# EasyEDA Pro project ProPrj_STM32H730_ESP-Hosted_EVB_2025-02-02.epro, board PCB2
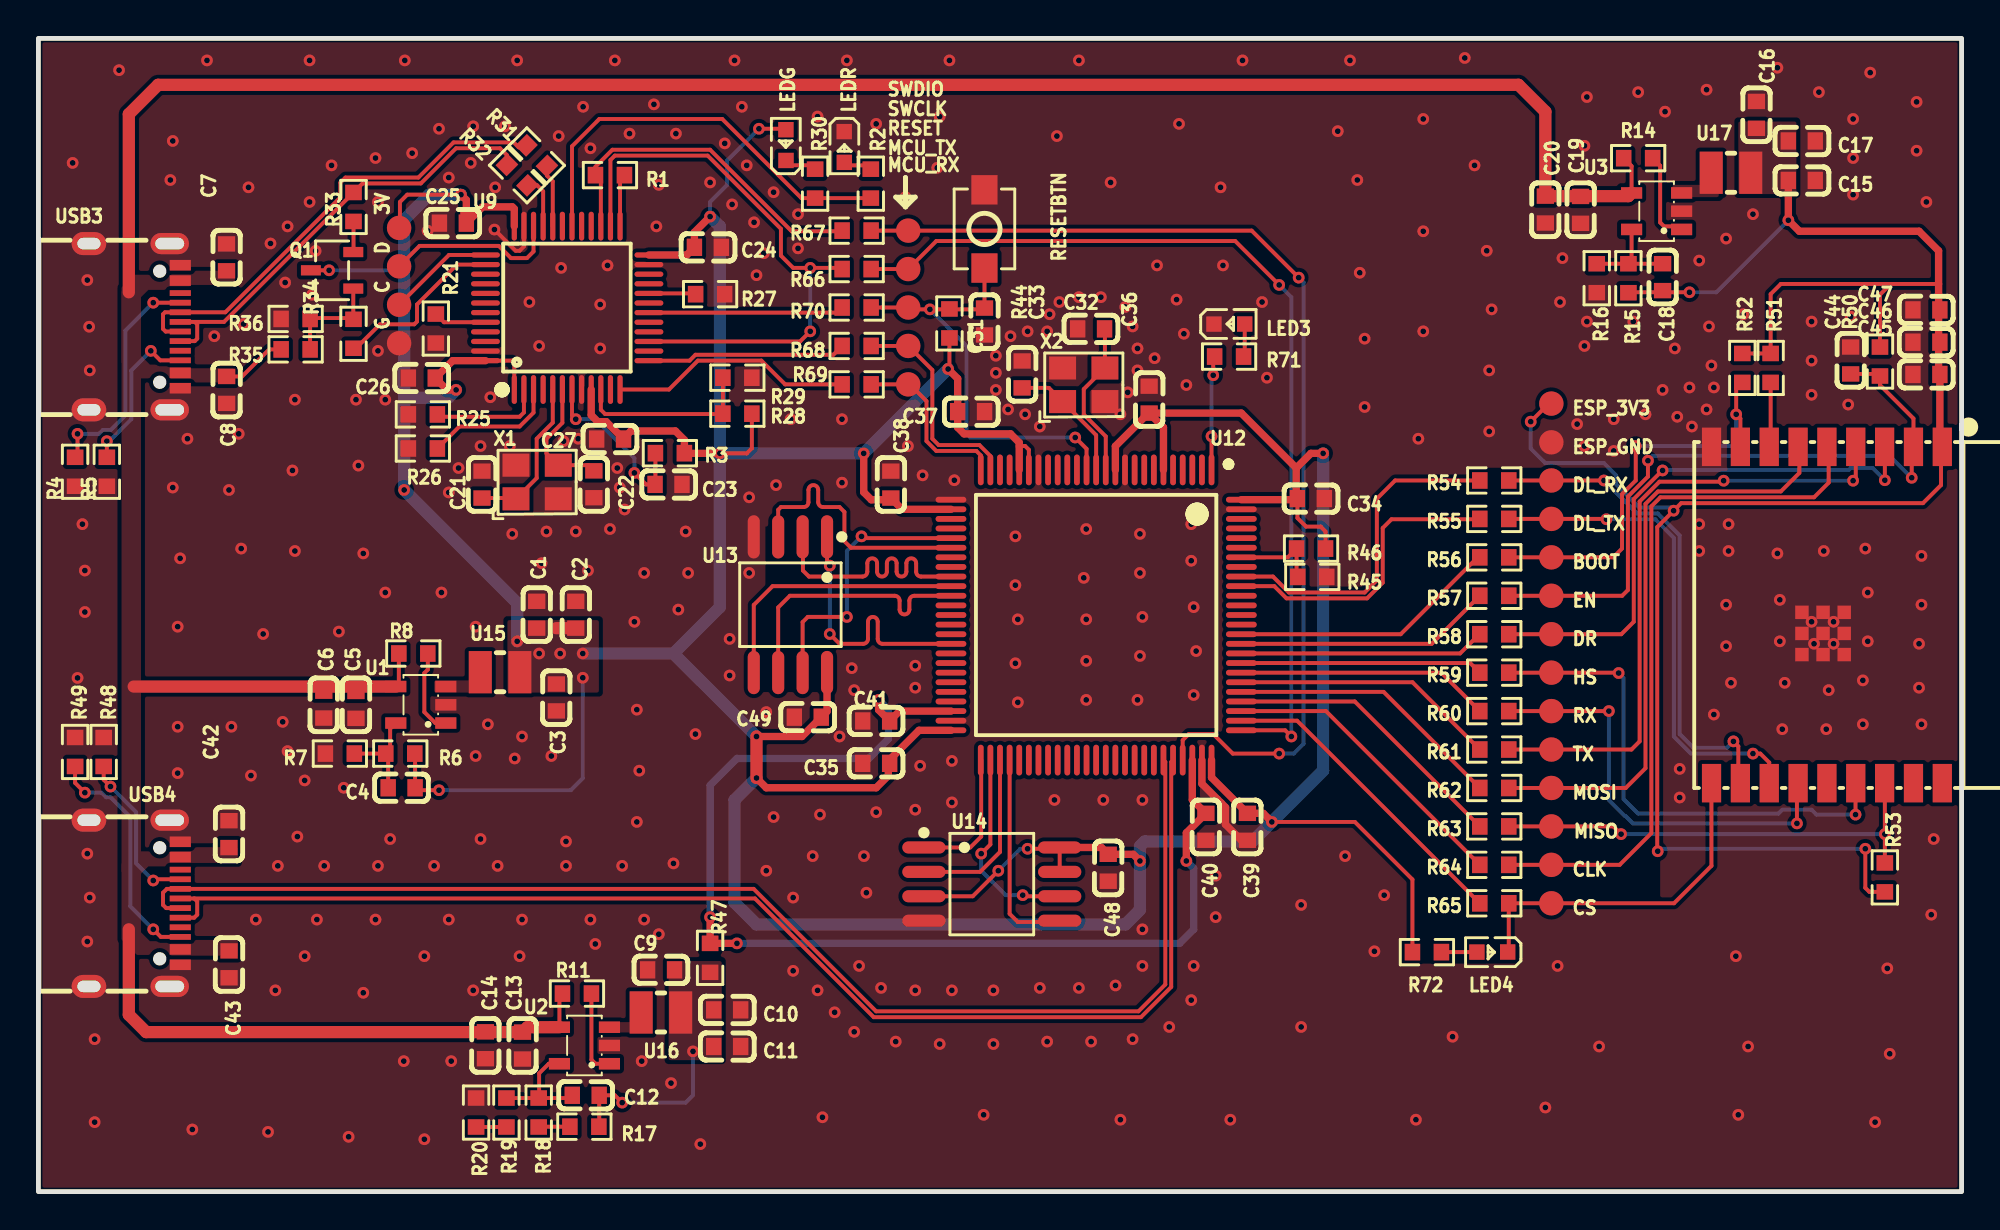
[diagram p5: board, top side]
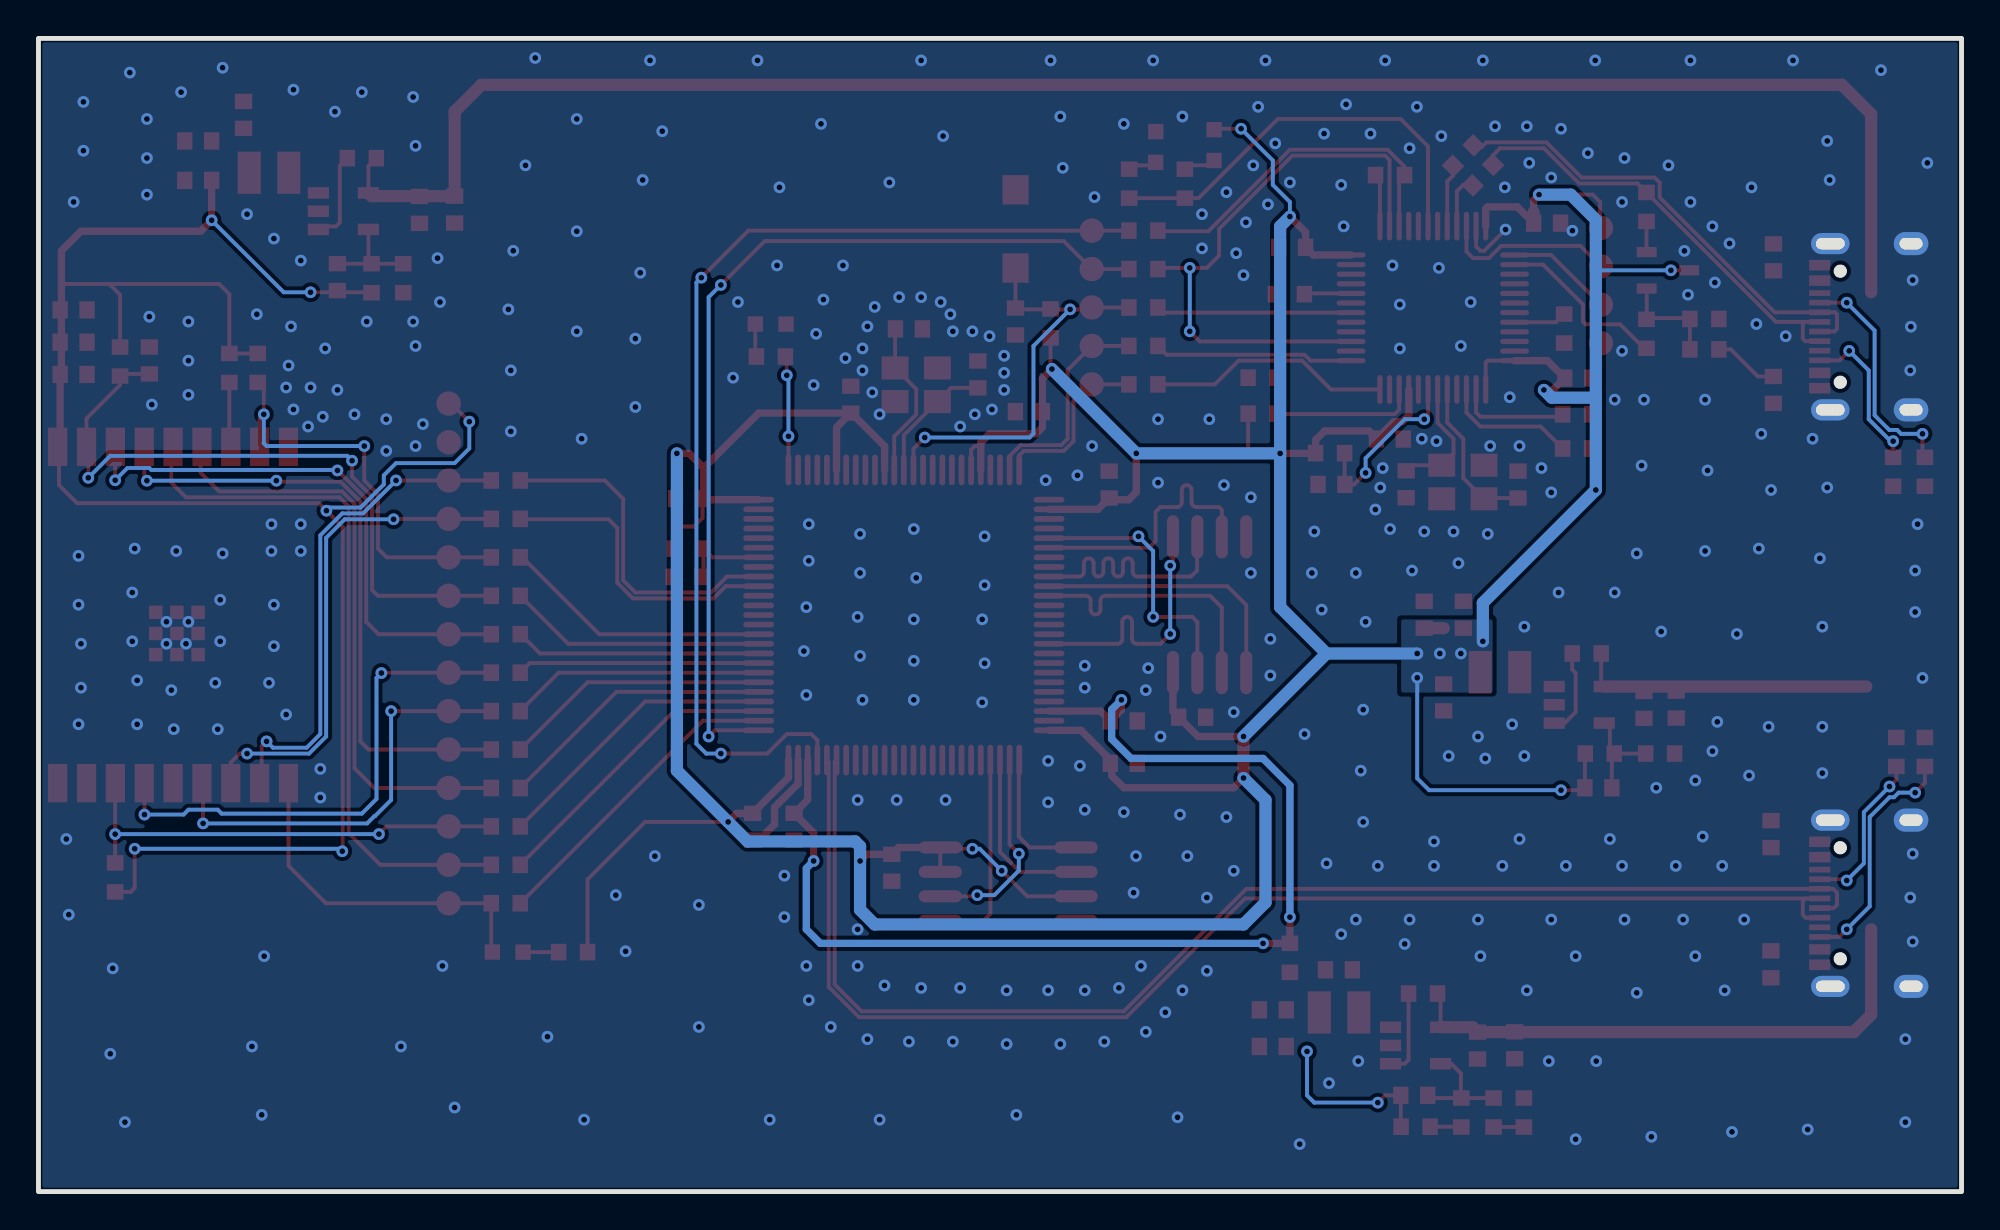
[diagram p6: board, bottom side, seen from below]

Outline 100 x 60 mm; copper layers: Top Layer, Bottom Layer. Coordinates in mm from the lower left corner of the outline.
Outline path: rectangle 0,60 100,0
Stack: Top Layer 0.035mm / Dielectric1 1.51mm FR4 er 4.5 / Bottom Layer 0.035mm

## Design rules (mm)
template: 自定义配置
spacing copperThickness1oz (default): track to track 0.102, other pairs 0.152 to 0.3
spacing copperThickness2oz: track to track 0.203, other pairs 0.152 to 0.3
track width copperThickness1oz (default): min 0.127, default 0.203, max 2.54
track width copperThickness2oz: min 0.203, default 0.254, max 2.54
differential pair differentialPair (default): width min 0.127, default 0.254, max 2.54; gap min 0.152, default 0.152
via viaSize (default): diameter min 0.5, default 0.61, max 10; hole min 0.3, default 0.305, max 6.299
pour e1192 uses ALL
pour e1223 uses ALL
pour e1563 uses ALL
pour e1588 uses ALL
pour e1603 uses ALL
pour e1605 uses ALL
pour e1638 uses ALL
pour e86 uses ALL
pour e163 uses ALL
pour e202 uses ALL
pour e339 uses ALL
pour e588 uses ALL
pour e685 uses ALL
pour e821 uses ALL
pour e1178 uses ALL
pour e1238 uses ALL

## Placement (name value [footprint] x y rotation side)
3V  -  [Test-Point-0.5mm]  18.75 50.14 0 top
BOOT  -  [Test-Point-0.5mm]  78.67 33 0 top
C  -  [Test-Point-0.5mm]  18.75 46.14 0 top
C1  100nF  [C0603]  25.91 30.01 270 top
C2  10uF  [C0603]  27.94 30.01 270 top
C3  10uF  [C0603]  26.93 25.71 90 top
C4  22p  [C0603]  18.89 21.01 0 top
C5  100nF  [C0603]  16.51 25.32 270 top
C6  10uF  [C0603]  14.84 25.34 90 top
C7  10uF  [C0603]  9.78 48.61 270 top
C8  10uF  [C0603]  9.78 41.71 90 top
C9  100nF  [C0603]  32.38 11.54 0 top
C10  10uF  [C0603]  35.81 9.45 180 top
C11  10uF  [C0603]  35.81 7.55 180 top
C12  22p  [C0603]  28.46 5.01 0 top
C13  100nF  [C0603]  25.17 7.6 270 top
C14  10uF  [C0603]  23.24 7.61 90 top
C15  100nF  [C0603]  91.69 52.61 180 top
C16  10uF  [C0603]  89.33 56.02 270 top
C17  10uF  [C0603]  91.69 54.67 180 top
C18  22p  [C0603]  84.46 47.58 270 top
C19  100nF  [C0603]  80.19 51.08 270 top
C20  10uF  [C0603]  78.36 51.09 90 top
C21  12p  [C0603]  23.06 36.79 270 top
C22  12p  [C0603]  28.88 36.8 90 top
C23  100nF  [C0603]  32.76 36.8 180 top
C24  100nF  [C0603]  34.81 49.13 180 top
C25  100nF  [C0603]  21.55 50.39 0 top
C26  100nF  [C0603]  19.93 42.33 0 top
C27  100nF  [C0603]  29.73 39.16 0 top
C31  22p  [C0603]  51.15 42.52 270 top
C32  22p  [C0603]  54.74 44.89 0 top
C33  100nF  [C0603]  49.19 45.27 90 top
C34  100nF  [C0603]  66.17 36.06 180 top
C35  100nF  [C0603]  43.56 22.28 0 top
C36  100nF  [C0603]  57.76 41.2 270 top
C37  100nF  [C0603]  48.5 40.58 180 top
C38  100nF  [C0603]  44.32 36.79 270 top
C39  100nF  [C0603]  62.87 18.98 90 top
C40  2.2uF  [C0603]  60.71 18.98 90 top
C41  2.2uF  [C0603]  43.56 24.49 0 top
C42  10uF  [C0603]  9.91 18.6 270 top
C43  10uF  [C0603]  9.91 11.82 90 top
C44  1uF  [C0603]  94.23 43.24 270 top
C45  100nF  [C0603]  98.17 42.52 0 top
C46  10uF  [C0603]  98.17 44.2 0 top
C47  10uF  [C0603]  98.17 45.88 0 top
C48  100nF  [C0603]  55.63 16.85 90 top
C49  100nF  [C0603]  40 24.68 0 top
CLK  -  [Test-Point-0.5mm]  78.67 17 0 top
CS  -  [Test-Point-0.5mm]  78.67 15 0 top
D  -  [Test-Point-0.5mm]  18.75 48.14 0 top
DL_RX  -  [Test-Point-0.5mm]  78.67 37 0 top
DL_TX  -  [Test-Point-0.5mm]  78.67 35 0 top
DR  -  [Test-Point-0.5mm]  78.67 29 0 top
EN  -  [Test-Point-0.5mm]  78.67 31 0 top
ESP_3V3  -  [Test-Point-0.5mm]  78.67 41 0 top
ESP_GND  -  [Test-Point-0.5mm]  78.67 38.98 0 top
G  -  [Test-Point-0.5mm]  18.75 44.14 0 top
HS  -  [Test-Point-0.5mm]  78.67 27 0 top
LED3  -  [LED_0603]  61.98 45.15 0 top
LED4  -  [LED_0603]  75.55 12.45 180 top
LEDG  -  [LED_0603]  38.86 54.5 90 top
LEDR  -  [LED_0603]  41.91 54.3 270 top
MCU_RX  -  [Test-Point-0.5mm]  45.23 42 0 top
MCU_TX  -  [Test-Point-0.5mm]  45.23 44 0 top
MISO  -  [Test-Point-0.5mm]  78.67 19 0 top
MOSI  -  [Test-Point-0.5mm]  78.67 21 0 top
Q1  S8050  [SOT-23-3_L3.0-W1.7-P0.95-LS2.9-BR]  15.27 47.94 0 top
R1  100R  [R0603]  29.72 52.89 180 top
R2  1k  [R0603]  43.28 52.44 90 top
R3  10K  [R0603]  32.84 38.42 0 top
R4  5K1  [R0603]  1.91 37.45 270 top
R5  5K1  [R0603]  3.56 37.45 270 top
R6  100k  [R0603]  18.81 22.79 0 top
R7  22.1k  [R0603]  15.67 22.79 0 top
R8  100K  [R0603]  19.49 28 180 top
R11  100K  [R0603]  28 10.3 180 top
R14  100K  [R0603]  83.19 53.77 180 top
R15  100k  [R0603]  82.68 47.52 270 top
R16  22.1k  [R0603]  81.03 47.52 90 top
R17  51k  [R0603]  28.39 3.38 0 top
R18  100k  [R0603]  26.01 4.11 90 top
R19  100k  [R0603]  24.33 4.11 90 top
R20  15k  [R0603]  22.76 4.11 90 top
R21  10K  [R0603]  20.66 44.9 90 top
R25  10k  [R0603]  19.99 40.44 180 top
R26  10k  [R0603]  19.99 38.66 180 top
R27  10k  [R0603]  34.93 46.69 0 top
R28  10K  [R0603]  36.34 40.48 0 top
R29  10K  [R0603]  36.34 42.35 180 top
R30  1k  [R0603]  40.39 52.44 90 top
R31  22R  [R0603]  25.91 53.9 315 top
R32  22R  [R0603]  24.89 52.89 315 top
R33  1.5K  [R0603]  16.38 51.23 270 top
R34  100R  [R0603]  16.38 44.63 270 top
R35  10K  [R0603]  13.37 43.82 180 top
R36  36K  [R0603]  13.37 45.41 0 top
R44  10K  [R0603]  47.37 45.17 90 top
R45  10K  [R0603]  66.24 31.98 0 top
R46  NC  [R0603]  66.17 33.46 0 top
R47  0R  [R0603]  34.93 12.16 270 top
R48  5K1  [R0603]  3.39 22.87 90 top
R49  5K1  [R0603]  1.91 22.87 90 top
R50  10K  [R0603]  95.76 43.19 270 top
R51  10K  [R0603]  90.07 42.86 270 top
R52  10K  [R0603]  88.6 42.86 270 top
R53  10K  [R0603]  96.01 16.35 270 top
R54  10R  [R0603]  75.7 37 0 top
R55  10R  [R0603]  75.7 35 0 top
R56  10R  [R0603]  75.7 33 0 top
R57  10R  [R0603]  75.7 31 0 top
R58  10R  [R0603]  75.7 29 0 top
R59  10R  [R0603]  75.7 27 0 top
R60  10R  [R0603]  75.7 25 0 top
R61  10R  [R0603]  75.7 23 0 top
R62  10R  [R0603]  75.7 21 0 top
R63  10R  [R0603]  75.7 19 0 top
R64  10R  [R0603]  75.7 17 0 top
R65  10R  [R0603]  75.7 15 0 top
R66  10R  [R0603]  42.54 48 180 top
R67  10R  [R0603]  42.54 50 180 top
R68  10R  [R0603]  42.54 44 0 top
R69  10R  [R0603]  42.54 42 0 top
R70  10R  [R0603]  42.54 46 0 top
R71  1K  [R0603]  61.91 43.45 180 top
R72  1K  [R0603]  72.2 12.46 180 top
RESET  -  [Test-Point-0.5mm]  45.23 46 0 top
RESETBTN  TS342A2P-WZ  [SW-SMD_L4.0-W2.9-LS5.0]  49.19 50.09 90 top
RX  -  [Test-Point-0.5mm]  78.67 25 0 top
SWCLK  -  [Test-Point-0.5mm]  45.23 48 0 top
SWDIO  -  [Test-Point-0.5mm]  45.23 50 0 top
TX  -  [Test-Point-0.5mm]  78.67 23 0 top
U1  SY8088AAC  [SOT-23-5_L3.0-W1.7-P0.95-LS2.8-BR]  19.88 25.33 0 top
U2  SY8088AAC  [SOT-23-5_L3.0-W1.7-P0.95-LS2.8-BR]  28.39 7.6 0 top
U3  SY8088AAC  [SOT-23-5_L3.0-W1.7-P0.95-LS2.8-BR]  84.14 51.01 0 top
U9  STM32F103CBT6  [LQFP-48_L7.0-W7.0-P0.50-LS9.0-BL]  27.49 45.98 0 top
U10  ESP32-C3-WROOM-02  [BULETM-SMD_ESPRESSIF_ESP32-C3-WROOM-02-N4-4MB]  93 30 270 top
U12  STM32H730VBT6TR  [LQFP-100_L14.0-W14.0-P0.50-LS16.0-BL]  55 30 180 top
U13  W25Q32JVSSIQ  [SOIC-8_L5.3-W5.3-P1.27-LS8.0-BL]  39.1 30.54 180 top
U14  W25Q32JVSSIQ  [SOIC-8_L5.3-W5.3-P1.27-LS8.0-BL]  49.57 16 270 top
U15  2.2uH  [IND-SMD_L2.5-W2.0]  24 27.02 180 top
U16  2.2uH  [IND-SMD_L2.5-W2.0]  32.37 9.32 180 top
U17  2.2uH  [IND-SMD_L2.5-W2.0]  88.01 53.01 180 top
USB3  TYPE-C 16PIN 2MD(073)  [USB-C-SMD_TYPE-C-6PIN-2MD-073]  5 45 270 top
USB4  TYPE-C 16PIN 2MD(073)  [USB-C-SMD_TYPE-C-6PIN-2MD-073]  5 15 270 top
X1  8MHz  [OSC-SMD_4P-L3.2-W2.5-BL]  25.93 36.92 0 top
X2  25MHz  [OSC-SMD_4P-L3.2-W2.5-BL]  54.36 41.98 0 top

## Footprints (pads in the part's own frame, mm; a bottom-side part is the same pattern mirrored in y, then rotated)
BULETM-SMD_ESPRESSIF_ESP32-C3-WROOM-02-N4-4MB
  rect 2x1 smd: 1(-8.75,6) 2(-8.75,4.5) 3(-8.75,3) 4(-8.75,1.5) 5(-8.75,0) 6(-8.75,-1.5) 7(-8.75,-3) 8(-8.75,-4.5) 9(-8.75,-6) 10(8.75,-6) 11(8.75,-4.5) 12(8.75,-3) 13(8.75,-1.5) 14(8.75,0) 15(8.75,1.5) 16(8.75,3) 17(8.75,4.5) 18(8.75,6)
  rect 0.7x0.7 smd: 19(-0.14,0.9) 19(-0.14,-0.2) 19(-0.14,-1.3) 19(0.96,0.9) 19(0.96,-0.2) 19(0.96,-1.3) 19(2.06,0.9) 19(2.06,-0.2) 19(2.06,-1.3)
C0603
  rect 0.8x0.9 smd: 1(-0.7,0) 2(0.7,0)
IND-SMD_L2.5-W2.0
  rect 1.2x2.2 smd: 1(1.028,0) 2(-1.028,0)
LED_0603
  rect 0.8x0.8 smd: 1(-0.851,-0.01) 2(0.75,-0.005)
LQFP-48_L7.0-W7.0-P0.50-LS9.0-BL
  oval 0.27x1.5 smd: 1(-2.75,-4.25) 2(-2.25,-4.25) 3(-1.75,-4.25) 4(-1.25,-4.25) 5(-0.75,-4.25) 6(-0.25,-4.25) 7(0.25,-4.25) 8(0.75,-4.25) 9(1.25,-4.25) 10(1.75,-4.25) 11(2.25,-4.25) 12(2.75,-4.25) 25(2.75,4.25) 26(2.25,4.25) 27(1.75,4.25) 28(1.25,4.25) 29(0.75,4.25) 30(0.25,4.25) 31(-0.25,4.25) 32(-0.75,4.25) 33(-1.25,4.25) 34(-1.75,4.25) 35(-2.25,4.25) 36(-2.75,4.25)
  oval 1.5x0.27 smd: 13(4.25,-2.75) 14(4.25,-2.25) 15(4.25,-1.75) 16(4.25,-1.25) 17(4.25,-0.75) 18(4.25,-0.25) 19(4.25,0.25) 20(4.25,0.75) 21(4.25,1.25) 22(4.25,1.75) 23(4.25,2.25) 24(4.25,2.75) 37(-4.25,2.75) 38(-4.25,2.25) 39(-4.25,1.75) 40(-4.25,1.25) 41(-4.25,0.75) 42(-4.25,0.25) 43(-4.25,-0.25) 44(-4.25,-0.75) 45(-4.25,-1.25) 46(-4.25,-1.75) 47(-4.25,-2.25) 48(-4.25,-2.75)
LQFP-100_L14.0-W14.0-P0.50-LS16.0-BL
  oval 0.3x1.6 smd: 1(-6,-7.55) 2(-5.5,-7.55) 3(-5,-7.55) 4(-4.5,-7.55) 5(-4,-7.55) 6(-3.5,-7.55) 7(-3,-7.55) 8(-2.5,-7.55) 9(-2,-7.55) 10(-1.5,-7.55) 11(-1,-7.55) 12(-0.5,-7.55) 13(0,-7.55) 14(0.5,-7.55) 15(1,-7.55) 16(1.5,-7.55) 17(2,-7.55) 18(2.5,-7.55) 19(3,-7.55) 20(3.5,-7.55) 21(4,-7.55) 22(4.5,-7.55) 23(5,-7.55) 24(5.5,-7.55) 25(6,-7.55) 51(6,7.55) 52(5.5,7.55) 53(5,7.55) 54(4.5,7.55) 55(4,7.55) 56(3.5,7.55) 57(3,7.55) 58(2.5,7.55) 59(2,7.55) 60(1.5,7.55) 61(1,7.55) 62(0.5,7.55) 63(0,7.55) 64(-0.5,7.55) 65(-1,7.55) 66(-1.5,7.55) 67(-2,7.55) 68(-2.5,7.55) 69(-3,7.55) 70(-3.5,7.55) 71(-4,7.55) 72(-4.5,7.55) 73(-5,7.55) 74(-5.5,7.55) 75(-6,7.55)
  oval 1.6x0.3 smd: 26(7.55,-6) 27(7.55,-5.5) 28(7.55,-5) 29(7.55,-4.5) 30(7.55,-4) 31(7.55,-3.5) 32(7.55,-3) 33(7.55,-2.5) 34(7.55,-2) 35(7.55,-1.5) 36(7.55,-1) 37(7.55,-0.5) 38(7.55,0) 39(7.55,0.5) 40(7.55,1) 41(7.55,1.5) 42(7.55,2) 43(7.55,2.5) 44(7.55,3) 45(7.55,3.5) 46(7.55,4) 47(7.55,4.5) 48(7.55,5) 49(7.55,5.5) 50(7.55,6) 76(-7.55,6) 77(-7.55,5.5) 78(-7.55,5) 79(-7.55,4.5) 80(-7.55,4) 81(-7.55,3.5) 82(-7.55,3) 83(-7.55,2.5) 84(-7.55,2) 85(-7.55,1.5) 86(-7.55,1) 87(-7.55,0.5) 88(-7.55,0) 89(-7.55,-0.5) 90(-7.55,-1) 91(-7.55,-1.5) 92(-7.55,-2) 93(-7.55,-2.5) 94(-7.55,-3) 95(-7.55,-3.5) 96(-7.55,-4) 97(-7.55,-4.5) 98(-7.55,-5) 99(-7.55,-5.5) 100(-7.55,-6)
OSC-SMD_4P-L3.2-W2.5-BL
  rect 1.4x1.2 smd: 1(-1.1,-0.875) 2(1.1,-0.875) 3(1.1,0.875) 4(-1.1,0.875)
R0603
  rect 0.806x0.864 smd: 1(-0.753,0) 2(0.753,0)
SOIC-8_L5.3-W5.3-P1.27-LS8.0-BL
  oval 0.63x2.25 smd: 1(-1.905,-3.53) 2(-0.635,-3.53) 3(0.635,-3.53) 4(1.905,-3.53) 5(1.905,3.53) 6(0.635,3.53) 7(-0.635,3.53) 8(-1.905,3.53)
SOT-23-3_L3.0-W1.7-P0.95-LS2.9-BR
  rect 1.038x0.532 smd: 1(1.101,-0.95) 2(1.101,0.95) 3(-1.101,0)
SOT-23-5_L3.0-W1.7-P0.95-LS2.8-BR
  rect 1.1x0.6 smd: 1(1.3,-0.95) 2(1.3,0) 3(1.3,0.95) 4(-1.3,0.95) 5(-1.3,-0.95)
SW-SMD_L4.0-W2.9-LS5.0
  rect 1.53x1.36 smd: 1(-2.035,0) 2(2.035,0)
Test-Point-0.5mm
  round 1.27 smd: 1(0,0)
USB-C-SMD_TYPE-C-6PIN-2MD-073
  rect 0.55x1.1 smd: 1(-3.2,2.375) 2(-2.4,2.375) 11(2.4,2.375) 12(3.2,2.375)
  rect 0.3x1.1 smd: 3(-1.75,2.375) 4(-1.25,2.375) 5(-0.75,2.375) 6(-0.25,2.375) 7(0.25,2.375) 8(0.75,2.375) 9(1.25,2.375) 10(1.75,2.375)
  oval 1.1x2 hole 0.6x1.5: 13(-4.325,1.825) 14(4.325,1.825)
  oval 1.2x1.8 hole 0.6x1.2: 13(-4.325,-2.375) 14(4.325,-2.375)

## Nets
As in the schematic.

Pads without a net: U9 4 11 14 16 17 19 21 22 28 29 31 39 40 41 42 43 45 46; U10 17 18; U12 2 3 4 5 7 8 9 15 16 17 18 22 23 28 29 32 33 37 38 39 40 42 43 44 45 46 47 55 56 57 58 59 60 61 62 63 64 65 66 67 68 69 87 88 89 90 93 95 96 97 98; USB3 3 9; USB4 3 9

## Via types
v1: diameter 0.61, hole 0.305, Top Layer to Bottom Layer, 469 vias

## Routing (per net, layer and track width the routed paths; a pad name or vN(x,y) marks a point on that pad's centre or on a via; arc(x,y) is an arc through that point)
+3.3V_ESP: length 108.2
  Top Layer w0.203: U10.1 98.93,38.68 98.93,36.76 97.99,35.82 85.42,35.82 v1(85.03,35.43) 84.18,34.58 84.18,17.73 v1(84.2,17.71) ; 96.32,47.22 90.6,47.22 90.07,46.7 R51.1 R52.1 ; 96.32,47.22 98.81,47.22 ; 96.32,47.22 95.76,46.67 R50.1 ; v1(85.85,46.79) 82.7,46.79 R15.2 ; v1(77.6,40.06) 78.54,41 ESP_3V3.1 ; R53.2 95.21,15.59 95,15.8 v1(95,17.84)
  Top Layer w0.381: U10.1 98.87,38.88 C45.2 98.81,42.58 98.81,48.95 97.79,49.97 91.57,49.97 v1(90.99,50.54) C15.2
  Bottom Layer w0.203: v1(85.85,46.79) 87.25,46.79 v1(90.99,50.54) ; v1(77.6,40.06) 77.6,38.66 78.36,37.9 81.41,37.9 82.04,37.27 82.04,36.8 83.25,35.59 84.86,35.59 v1(85.03,35.43) ; v1(84.2,17.71) 84.33,17.84 v1(95,17.84)
+3.3V_MCU: length 298.7
  Top Layer w0.203: 3V.1 18.8,50.18 18.8,51.49 19.18,51.87 v1(21.97,51.87) ; v1(51.44,17.84) 53.04,17.84 U14.8 U14.7 ; 51,38.79 51.31,38.79 51.5,38.6 U12.20 ; R28.2 37.1,38.68 36.83,38.41 v1(35.43,38.41) ; v1(49.91,16.69) 48.58,15.36 U14.3 ; U9.48 23.25,43.24 24.64,43.24 24.74,43.13 U9.1 ; R44.1 47.37,42.87 v1(47.3,42.8) ; R46.2 66.93,34.35 66.68,34.6 65.91,34.6 65.47,35.05 C34.2 ; R6.2 19.58,22.77 19.58,21.01 19.71,20.88 v1(20.83,20.88) ; LEDG.2 38.82,55.3 v1(37.47,55.3) ; v1(64.13,19.23) 68.45,19.23 71.45,16.24 R72.2 ; Q1.3 v1(15.11,47.94)
  Top Layer w0.381: v1(57.28,17.2) 56.93,17.55 C48.2 55.27,17.9 U14.8 ; v1(21.97,51.87) 22.25,51.59 22.25,50.96 ; v1(21.72,41.71) 21.25,41.71 C26.2 21.54,43.23 U9.48 ; C36.2 57.72,40.5 56,38.78 U12.11 ; C36.2 62.55,40.5 65.41,37.65 ; C36.2 58.5,39.76 U12.6 ; U9.36 24.74,51.13 24.64,51.24 23.1,51.24 C25.2 ; U13.8 41.01,24.98 C49.2 39.7,23.68 v1(37.34,23.68) ; v1(64.13,19.23) 63.69,19.68 C39.2 61,21.54 U12.75 ; v1(66.8,38.41) 66.17,38.41 65.41,37.65 ; 65.41,37.65 65.41,36.12 C34.2 65.41,36 U12.100 ; v1(42.91,38.41) 42.91,36.39 43.31,36 44.23,36 C38.2 44.91,35.5 U12.27 ; U9.24 33.71,48.73 C24.2 34.11,49.91 v1(34.93,50.73) ; v1(37.34,21.52) 37.85,21.01 43.56,21.01 44.19,21.64 44.19,22.41 45.79,24 U12.50 ; v1(35.43,38.41) 33.6,38.41 R3.2 33.59,39.11 33.12,39.57 30.81,39.57 30.43,39.19 C27.2 29.52,40.06 29.08,40.06 28.74,40.4 U9.9 ; v1(47.3,42.8) 47.8,42.3 C37.2 47.8,39.76 48.13,39.43 50.55,39.43 51,38.97 U12.21
  Top Layer w0.635: 22.25,50.96 C25.2 ; 26.92,29.31 C2.2 ; v1(37.34,23.68) v1(37.34,21.52)
  Bottom Layer w0.203: v1(34.93,50.73) 34.93,51.49 35.81,52.38 35.81,53.65 v1(37.47,55.3) ; v1(49.91,16.69) 51.05,17.84 v1(51.44,17.84) ; v1(20.83,20.88) 27.69,20.88 28.31,21.5 v1(28.31,26.73) ; v1(15.11,47.94) 19,47.94 19.02,47.95
  Bottom Layer w0.635: v1(21.72,41.71) 21.31,41.31 19.02,41.31 ; 19.02,41.31 19.02,50.57 20.32,51.87 v1(21.97,51.87) ; 19.02,41.31 v1(19.02,36.5) 24.89,30.63 v1(24.89,28.63) ; v1(66.8,38.41) 66.8,21.9 v1(64.13,19.23) 63.12,18.22 57.53,18.22 57.28,17.96 v1(57.28,17.2) 57.28,14.66 56.51,13.9 37.34,13.9 36.19,15.04 36.19,20.38 v1(37.34,21.52) ; v1(35.43,38.41) 35.43,30.41 33.02,28 ; v1(35.43,38.41) 35.43,50.22 v1(34.93,50.73) ; v1(35.43,38.41) v1(42.91,38.41) v1(47.3,42.8) ; 33.02,28 v1(37.34,23.68) ; 33.02,28 v1(28.31,28)
  vias: v1(26.03,28) v1(27.13,28)
+5V: length 143
  Top Layer w0.203: R11.2 27.09,10.14 U2.4 ; R14.2 82.84,53.36 U3.4 ; C8.2 10.59,42.41 12,43.82 R35.2 ; 18.58,26.28 18.74,26.44 R8.2
  Top Layer w0.635: 18.58,26.28 4.95,26.28 ; 4.7,46.79 4.7,56.06 6.22,57.59 76.96,57.59 78.36,56.19 C20.2 82.68,51.79 U3.4 ; 4.7,13.64 4.7,9.2 5.6,8.3 C13.1 25.42,8.55 U2.4
GND: length 8.5
  Top Layer w0.203: v1(23.71,50.06) 24.82,48.95 25.02,48.95 25.24,49.18 U9.35
  Top Layer w0.381: C39.1 62.55,18.28 61.72,19.11 61.72,20 61.5,20.22 61.5,20.22 61.3,20.42 61.29,20.42 60.5,21.22 U12.74
  vias: v1(1.78,53.52) v1(2.03,26.73) v1(2.29,34.73) v1(2.41,32.31) v1(2.41,30.16) v1(2.54,47.43) v1(2.54,17.58) v1(2.54,13.01) v1(2.64,45) v1(2.67,42.73) v1(2.67,15.3) v1(2.92,7.93) v1(2.92,3.61) v1(4.19,58.35) v1(6.86,52.63) v1(6.98,54.67) v1(6.98,36.63) v1(7.24,29.39) v1(7.24,24.19) v1(7.24,21.77) v1(7.37,32.95) v1(7.75,39.17) v1(8,3.23) v1(8.76,58.86) v1(9.14,44.51) v1(9.91,36.5) v1(10.03,24.19) v1(10.41,39.43) v1(10.54,33.46) v1(10.67,45.14) v1(10.92,52.25) v1(11.05,21.65) v1(11.3,14.15) v1(11.68,29.01) v1(11.94,3.1) v1(12.06,49.33) v1(12.32,10.47) v1(12.45,16.95) v1(12.7,24.44) v1(12.83,47.3) v1(12.95,50.22) v1(12.95,22.92) v1(13.21,37.52) v1(13.33,41.2) v1(13.33,33.33) v1(13.46,18.47) v1(13.84,21.39) v1(13.84,12.25) v1(14.1,58.86) v1(14.1,51.49) v1(14.22,46.67) v1(14.41,48.95) v1(14.48,14.15) v1(14.86,16.95) v1(15.24,53.4) v1(15.62,29.14) v1(15.88,21.01) v1(16.13,2.85) v1(16.51,41.2) v1(16.64,37.78) v1(16.89,33.2) v1(16.89,10.34) v1(17.53,53.78) v1(17.53,14.15) v1(17.65,51.49) v1(17.65,43.74) v1(17.65,16.95) v1(18.03,41.2) v1(18.03,31.17) v1(18.29,18.34) v1(19.05,58.86) v1(19,6.79) v1(19.43,54.03) v1(20.07,12.25) v1(20.07,2.72) v1(20.24,50) v1(20.57,16.95) v1(20.83,55.3) v1(20.95,31.17) v1(21.34,52.76) v1(21.34,36.38) v1(21.34,14.15) v1(21.46,6.79) v1(21.84,37.65) v1(22.48,53.52) v1(22.61,55.43) v1(22.61,10.47) v1(22.73,29.39) v1(22.73,22.66) v1(22.99,38.79) v1(22.99,18.34) v1(23.37,24.31) v1(23.5,41.33) v1(23.75,52.25) v1(23.88,16.95) v1(24.26,55.43) v1(24.51,38.79) v1(24.64,34.22) v1(24.77,22.53) v1(24.89,58.86) v1(25.02,12.25) v1(25.15,23.68) v1(25.15,14.15) v1(25.53,46.28) v1(26.03,44) v1(26.16,32.69) v1(26.42,34.35) v1(26.67,22.66) v1(27.05,54.92) v1(27.18,48.06) v1(27.31,39.05) v1(27.43,18.22) v1(27.43,16.95) v1(27.94,34.35) v1(28.07,39.17) v1(28.32,56.44) v1(28.57,32.31) v1(28.7,54.28) v1(28.7,14.15) v1(28.96,12.88) v1(29.21,46.16) v1(29.21,43.87) v1(29.59,48.19) v1(29.72,34.47) v1(29.97,58.86) v1(30.1,37.65) v1(30.23,36.63) v1(30.35,16.95) v1(30.48,35.49) v1(30.73,55.05) v1(30.99,29.65) v1(31.12,25.08) v1(31.12,19.23) v1(31.24,21.9) v1(31.37,6.79) v1(31.5,32.19) v1(31.5,14.15) v1(32,56.57) v1(32.13,50.22) v1(32.26,52.38) v1(32.26,13.39) v1(32.89,5.64) v1(33.02,17.07) v1(33.15,55.05) v1(33.27,30.28) v1(33.66,34.35) v1(33.78,32.19) v1(34.16,23.81) v1(34.42,2.47) v1(34.93,52.51) v1(35.69,54.54) v1(35.94,28.76) v1(35.94,26.85) v1(36.07,51.36) v1(36.19,58.86) v1(36.58,56.44) v1(36.83,53.4) v1(36.96,36.12) v1(36.96,32.19) v1(37.21,50.43) v1(37.34,47.68) v1(37.72,48.82) v1(37.85,24.95) v1(37.85,16.69) v1(38.23,52) v1(38.23,19.49) v1(38.35,36.76) v1(39.12,40.19) v1(39.24,15.3) v1(39.24,11.49) v1(39.5,50.86) v1(39.5,49.08) v1(40.26,17.45) v1(40.51,55.94) v1(40.51,10.47) v1(40.64,19.61) v1(40.77,3.87) v1(41.4,9.33) v1(41.66,23.68) v1(41.78,40.19) v1(41.78,36.89) v1(42.04,58.86) v1(42.29,27.23) v1(42.42,26.09) v1(42.42,8.31) v1(42.67,11.74) v1(42.93,17.45) v1(43.05,15.55) v1(43.56,55.56) v1(43.56,19.74) v1(43.81,10.6) v1(44.58,7.8) v1(45.09,51.75) v1(45.21,38.79) v1(45.59,27.36) v1(45.59,26.22) v1(45.59,19.87) v1(45.59,10.47) v1(45.85,22.15) v1(45.97,37.27) v1(46.74,53.27) v1(46.86,55.94) v1(46.86,7.68) v1(47.37,58.86) v1(47.5,22.41) v1(47.5,20.25) v1(47.5,10.47) v1(47.62,37.01) v1(49.15,3.99) v1(49.66,10.47) v1(49.66,7.68) v1(49.78,43.49) v1(49.78,42.6) v1(49.78,41.71) v1(50.42,40.7) v1(50.55,44.51) v1(50.8,34.09) v1(50.8,31.55) v1(50.8,27.49) v1(50.93,29.77) v1(50.93,25.46) v1(51.31,40.44) v1(51.44,44.76) v1(52.07,39.81) v1(52.07,10.6) v1(52.45,44.76) v1(52.45,7.8) v1(52.58,45.65) v1(52.83,20.38) v1(52.96,54.92) v1(53.09,46.28) v1(54.1,58.86) v1(54.1,46.54) v1(54.1,10.6) v1(54.36,31.93) v1(54.48,34.47) v1(54.48,29.77) v1(54.48,27.61) v1(54.48,25.58) v1(54.74,7.8) v1(55.25,46.54) v1(55.37,20.38) v1(55.75,52.51) v1(56.01,10.72) v1(56.26,40.44) v1(56.26,3.74) v1(56.51,46.03) v1(56.64,41.58) v1(56.9,45.01) v1(56.9,7.93) v1(57.15,43.87) v1(57.15,42.73) v1(57.15,25.58) v1(57.28,34.22) v1(57.28,32.19) v1(57.28,27.87) v1(57.4,29.9) v1(57.4,20.38) v1(57.4,13.64) v1(57.4,11.74) v1(58.04,43.36) v1(58.17,48.19) v1(58.8,8.56) v1(59.18,46.41) v1(59.31,55.56) v1(59.56,44.63) v1(59.69,41.97) v1(59.94,34.73) v1(59.94,32.82) v1(59.94,9.96) v1(60.07,30.41) v1(60.07,25.84) v1(60.07,11.74) v1(60.2,28.12) v1(61.21,16.44) v1(61.21,14.28) v1(61.47,52.25) v1(61.59,48.19) v1(61.98,3.74) v1(62.61,58.86) v1(63.63,46.28) v1(63.88,42.35) v1(65.66,14.92) v1(65.66,8.56) v1(67.56,55.17) v1(67.94,17.45) v1(68.2,58.86) v1(68.58,52.63) v1(68.71,47.81) v1(68.96,44.38) v1(68.96,40.82) v1(69.47,12.5) v1(69.98,15.42) v1(71.63,3.74) v1(71.75,39.17) v1(72.01,55.81) v1(72.01,49.97) v1(72.01,44.76) v1(73.53,8.06) v1(74.17,58.98) v1(74.68,53.4) v1(75.31,48.95) v1(75.44,42.73) v1(75.44,39.55) v1(75.56,45.9) v1(78.36,4.37) v1(78.99,11.74) v1(79.12,46.28) v1(79.25,48.57) v1(80.01,39.93) v1(80.39,54.41) v1(80.39,44) v1(80.39,38.79) v1(80.52,56.95) v1(80.52,45.27) v1(81.15,7.55) v1(81.91,40.19) v1(81.91,38.54) v1(82.93,45.27) v1(83.19,57.21) v1(83.57,40.44) v1(84.46,41.71) v1(84.58,56.19) v1(85.09,43.87) v1(85.22,40.31) v1(85.34,21.99) v1(85.34,20.5) v1(85.85,41.84) v1(85.98,39.81) v1(86.36,48.44) v1(86.36,34.73) v1(86.36,33.33) v1(86.74,57.33) v1(86.74,40.7) v1(86.87,45.01) v1(87,42.98) v1(87.12,41.84) v1(87.12,24.82) v1(87.76,49.59) v1(87.76,30.54) v1(87.76,28.38) v1(87.88,34.73) v1(87.88,33.33) v1(88.01,26.47) v1(88.26,12.25) v1(88.39,3.99) v1(88.65,45.65) v1(88.9,7.55) v1(89.15,50.86) v1(90.42,58.48) v1(90.42,33.2) v1(90.55,30.79) v1(90.55,28.63) v1(90.68,24.06) v1(90.81,26.47) v1(92.2,45.27) v1(92.2,43.24) v1(92.2,41.46) v1(92.2,29.65) v1(92.33,28.5) v1(92.58,57.21) v1(92.84,33.33) v1(92.96,24.06) v1(93.09,26.09) v1(93.34,29.65) v1(93.34,28.5) v1(94.11,40.95) v1(94.23,45.52) v1(94.36,55.81) v1(94.36,53.78) v1(94.36,51.87) v1(94.87,26.6) v1(94.87,24.31) v1(95,33.46) v1(95.12,31.17) v1(95.12,28.63) v1(95.25,58.22) v1(95.5,3.61) v1(96.14,11.61) v1(96.27,7.17) v1(97.66,56.7) v1(97.66,54.16) v1(97.79,28.5) v1(97.79,26.22) v1(97.92,33.08) v1(97.92,30.54) v1(97.92,24.31) v1(98.17,51.49) v1(98.43,14.41) v1(98.55,18.34)
+VCAP_MCU: length 60.6
  Top Layer w0.381: v1(34.93,14.28) 34.93,12.91 v1(36.32,12.91) ; U12.73 60,20.39 C40.2 59.69,18.66 v1(59.69,17.2) ; U12.48 44.78,25 C41.2 43.69,25.06 v1(43.69,25.58)
  Bottom Layer w0.381: v1(59.69,17.2) 60.07,16.82 60.07,13.64 59.34,12.91 v1(36.32,12.91) ; v1(34.93,14.28) 34.93,21.14 36.32,22.53 43.18,22.53 44.2,23.55 44.2,25.08 v1(43.69,25.58)
CC1: length 12
  Top Layer w0.203: R4.1 2.03,38.33 v1(2.03,39.43) ; USB3.4 v1(5.97,46.25)
  Bottom Layer w0.203: v1(2.03,39.43) 3.15,39.43 3.35,39.63 3.76,39.63 4.52,40.39 4.52,44.8 v1(5.97,46.25)
CC2: length 8.3
  Top Layer w0.203: v1(3.56,39.05) R5.1 ; USB3.10 6.34,43.25 v1(5.84,43.74)
  Bottom Layer w0.203: v1(5.84,43.74) 4.83,42.73 4.83,40.19 3.68,39.05 v1(3.56,39.05)
DBG_AIN: length 9.4
  Top Layer w0.203: R29.2 R28.1 35.57,40.45 29.47,40.45 29.24,40.68 U9.10
DBG_LED: length 22
  Top Layer w0.203: U9.30 27.74,54.39 29.16,55.81 35.56,55.81 39.67,51.69 43.28,51.69
DBG_RST: length 9.2
  Top Layer w0.203: U9.7 27.74,40.38 v1(27.94,40.19) ; R3.1 32.08,36.81 C23.2 ; v1(30.99,37.39) 31.59,36.79 32.06,36.79
  Bottom Layer w0.203: v1(27.94,40.19) 28.96,40.19 30.99,38.16 v1(30.99,37.39)
DBG_SWCLK: length 5.6
  Top Layer w0.203: U9.37 21.34,48.73 C.1
DBG_SWDIO: length 9.2
  Top Layer w0.203: D.1 19.82,49.2 23.94,49.2 24.57,48.57 25.4,48.57 25.74,48.91 U9.34
DBG_USB_DN: length 3.3
  Top Layer w0.203: U9.32 26.74,52.56 26.44,52.86 R31.2
DBG_USB_DP: length 2.8
  Top Layer w0.203: U9.33 26.24,52.04 25.93,52.36 R32.2
DBG_USB_RE: length 9.2
  Top Layer w0.203: U9.38 21.76,48.23 19.69,46.16 19.69,45.27 19.54,45.12 17.76,45.12 16.51,43.88 R34.2
ESP_BOOT: length 22.1
  Top Layer w0.203: R56.2 BOOT.1 81.89,33 82.34,33.46 82.34,36.29 83.06,37 v1(83.06,38.79) ; U10.8 88.5,40.22 v1(88.28,40.44) 88.28,41.78 R52.2
  Bottom Layer w0.203: v1(83.06,38.79) 88.14,38.79 88.28,38.93 v1(88.28,40.44)
ESP_DL_RX: length 26
  Top Layer w0.203: U10.11 88.39,21.36 88.39,23.17 v1(88.14,23.42) ; R54.2 DL_RX.1 v1(81.41,37)
  Bottom Layer w0.203: v1(81.41,37) 83.12,35.29 84.2,35.29 85.34,34.14 85.34,23.81 86.06,23.09 87.81,23.09 v1(88.14,23.42)
ESP_DL_TX: length 25.9
  Top Layer w0.203: U10.12 90,22.32 89.53,22.79 v1(89.15,22.79) ; v1(81.53,34.98) 81.51,35 DL_TX.1 R55.2
  Bottom Layer w0.203: v1(89.15,22.79) 85.93,22.79 85.04,23.68 85.04,34.02 84.07,34.98 v1(81.53,34.98)
ESP_DR: length 28.9
  Top Layer w0.203: R58.2 DR.1 82.31,29 82.96,29.65 82.96,36.03 84.44,37.52 v1(84.46,37.52) ; v1(96.01,37.01) 96.01,38.74 U10.3
  Bottom Layer w0.203: v1(96.01,37.01) 95.38,37.65 94.23,37.65 94.13,37.55 84.48,37.55 v1(84.46,37.52)
ESP_EN: length 35.4
  Top Layer w0.203: C44.2 95.65,42.54 R50.2 95.76,41.97 97.5,40.22 U10.2 97.41,38.66 v1(97.41,37.14) ; v1(83.69,38.03) 83.69,37.2 82.65,36.16 82.65,31.3 82.35,31 EN.1 R57.2
  Bottom Layer w0.203: v1(97.41,37.14) 96.27,38.28 83.95,38.28 v1(83.69,38.03)
ESP_HS: length 26.6
  Top Layer w0.203: R59.2 HS.1 82.15,27 v1(82.17,26.98) ; U10.15 94.49,21.24 v1(94.49,19.61)
  Bottom Layer w0.203: v1(82.17,26.98) 82.42,26.73 82.42,20.43 83.19,19.67 90.47,19.67 90.68,19.87 92.2,19.87 92.46,19.61 v1(94.49,19.61)
ESP_SPI_CLK: length 36.7
  Top Layer w0.203: R64.2 CLK.1 82.22,17 83.87,18.65 83.87,35.65 84.34,36.12 92.33,36.12 93.09,36.89 93.09,38.66 U10.5
ESP_SPI_CS: length 18.2
  Top Layer w0.203: LED4.1 76.46,12.52 R65.2 CS.1 85.05,15 87,16.95 87,21.25 U10.10
ESP_SPI_MISO: length 23.9
  Top Layer w0.203: R63.2 MISO.1 81.89,19 v1(82.3,18.6) ; U10.16 96.01,21.24 v1(96.01,18.6) R53.1
  Bottom Layer w0.203: v1(82.3,18.6) v1(96.01,18.6)
ESP_SPI_MOSI: length 31.3
  Top Layer w0.203: U10.6 91.57,38.68 91.57,37.39 90.6,36.43 84.21,36.43 83.57,35.78 83.57,22.03 82.54,21 MOSI.1 R62.2
ESP_UART_CTS: length 3.4
  Top Layer w0.203: R51.2 90.07,38.82 U10.7
ESP_UART_RX: length 22.2
  Top Layer w0.203: U10.13 91.44,21.19 v1(91.44,19.16) ; R60.2 RX.1 v1(81.66,25)
  Bottom Layer w0.203: v1(91.44,19.16) 82.91,19.16 82.53,19.54 82.5,19.54 81.66,20.38 v1(81.66,25)
ESP_UART_TX: length 32.8
  Top Layer w0.203: U10.4 94.5,37.13 v1(94.36,36.99) ; v1(87.63,36.99) 87.58,36.94 84.29,36.94 83.26,35.91 83.26,23.42 82.84,23 TX.1 R61.2
  Bottom Layer w0.203: v1(87.63,36.99) v1(94.36,36.99)
EXT_CLK: length 10
  Top Layer w0.203: v1(49.02,17.58) 49.5,18.06 U12.52 ; 52.51,15.36 51.24,15.36 v1(51.18,15.42)
  Bottom Layer w0.203: v1(51.18,15.42) 50.3,15.42 49.02,16.7 v1(49.02,17.58)
EXT_CS: length 7.8
  Top Layer w0.203: U12.51 49.02,22.43 49.02,18.47 48.46,17.9 45.45,17.9
EXT_MISO: length 9.8
  Top Layer w0.203: U12.53 50,17.67 48.96,16.63 45.45,16.63
EXT_MOSI: length 10.2
  Top Layer w0.203: 52.51,14.09 52.38,14.09 52.32,14.03 50.93,14.03 50.5,14.45 U12.54
MAIN_CLK: length 14.1
  Top Layer w0.203: U13.6 38.47,30.39 39.07,31 44.53,31 arc(44.71,30.93) 44.78,30.75 44.78,30.28 arc(45.03,30.03) 45.29,30.28 45.29,30.75 arc(45.36,30.93) 45.54,31 U12.36
MAIN_CS: length 14
  Top Layer w0.203: v1(41.15,32.57) 41.01,32.71 U13.1 ; U12.41 43.9,28.5 arc(43.72,28.57) 43.64,28.75 43.64,29.65 arc(43.39,29.9) 43.13,29.65 43.13,28.75 arc(43.06,28.57) 42.88,28.5 41.66,28.5 v1(41.15,29.01)
  Bottom Layer w0.203: v1(41.15,32.57) v1(41.15,29.01)
MAIN_IO0: length 14.2
  Top Layer w0.203: U12.35 38.18,31.5 37.2,30.52 U13.5
MAIN_IO1: length 14
  Top Layer w0.203: U13.2 39.75,34.05 39.75,32.31 40.06,32 42.85,32 arc(43.03,32.07) 43.1,32.25 43.1,32.69 arc(43.35,32.95) 43.61,32.69 43.61,32.25 arc(43.86,32) 44.12,32.25 44.12,32.69 arc(44.37,32.95) 44.62,32.69 44.62,32.25 arc(44.88,32) 45.13,32.25 45.13,32.69 arc(45.39,32.95) 45.64,32.69 45.64,32.25 arc(45.71,32.07) 45.89,32 U12.34
MAIN_IO2: length 14.1
  Top Layer w0.203: U12.31 42.25,33.5 41.91,33.84 41.91,35.36 41.66,35.62 40.8,35.62 arc(40.62,35.69) 40.55,35.87 40.55,36.5 arc(40.29,36.76) 40.04,36.5 40.04,35.87 arc(39.97,35.69) 39.79,35.62 38.61,35.62 38.47,35.47 U13.3
MAIN_IO3: length 14.2
  Top Layer w0.203: U13.7 39.74,29.63 40,29.9 v1(42.04,29.9) ; v1(42.8,34.09) 42.89,34 U12.30
  Bottom Layer w0.203: v1(42.8,34.09) 42.04,33.33 v1(42.04,29.9)
STM_OSCI: length 6.7
  Top Layer w0.203: C31.2 52.54,41.82 X2.1 55,39.36 U12.13
STM_OSCO: length 8.3
  Top Layer w0.203: U12.12 55.5,39.29 54.36,40.43 54.36,41.75 X2.3 55.46,44.87 C32.2
STM_RST: length 23.6
  Top Layer w0.203: R70.2 RESET.1 45.33,45.9 v1(46.35,45.9) 49.51,45.9 49.44,45.97 C33.2 49.19,48.05 RESETBTN.1 ; v1(53.91,39.24) 54.5,38.65 U12.14
  Bottom Layer w0.203: v1(53.91,39.24) 48.46,39.24 48.26,39.44 48.26,44 v1(46.35,45.9)
STM_SPI3_MISO: length 15.1
  Top Layer w0.203: U12.79 68.45,25.5 R63.1
STM_SPI3_MOSI: length 14.5
  Top Layer w0.203: U12.80 69.95,26 R62.1
STM_SPI3_NCS: length 16.3
  Top Layer w0.203: U12.77 65.45,24.5 R65.1
STM_SPI3_SCK: length 15.7
  Top Layer w0.203: R64.1 66.95,25 U12.78
STM_SWCLK: length 49.3
  Top Layer w0.203: v1(65.15,23.68) 64.83,24 U12.76 ; v1(64.52,47.17) 62.23,49.46 46.69,49.46 SWCLK.1 R66.1
  Bottom Layer w0.203: v1(65.15,23.68) 65.15,46.54 v1(64.52,47.17)
STM_SWDIO: length 55.7
  Top Layer w0.203: v1(64.52,22.79) 62.1,22.79 61.09,23.81 59.82,23.81 59.5,23.49 U12.72 ; v1(65.53,47.55) 63.09,50 SWDIO.1 R67.1
  Bottom Layer w0.203: v1(64.52,22.79) 65.28,22.79 65.79,23.3 65.79,47.3 v1(65.53,47.55)
STM_U2_RX: length 9.2
  Top Layer w0.203: U12.25 49,38.31 48.77,38.54 46.69,38.54 46.18,39.05 46.18,41.13 45.31,42 MCU_RX.1 R69.2
STM_U2_TX: length 11.4
  Top Layer w0.203: U12.24 49.5,38.27 48.93,38.84 46.81,38.84 46.48,39.17 46.48,42.75 MCU_TX.1 R68.2
STM_U4_RX: length 13.8
  Top Layer w0.203: U12.81 71.45,26.5 R61.1
STM_U4_TX: length 13.2
  Top Layer w0.203: U12.82 72.95,27 R60.1
STM_U5_RX: length 16
  Top Layer w0.203: R55.1 74.93,34.98 70.36,34.98 69.9,34.52 69.9,31.68 69.09,30.87 64.9,30.87 64.26,31.5 U12.91
STM_U5_TX: length 17.6
  Top Layer w0.203: U12.92 64.19,32 65.02,31.17 68.96,31.17 69.6,31.81 69.6,36.05 70.55,37 R54.1
STM_USB_DN: length 68.7
  Top Layer w0.203: USB4.7 6.64,14.75 6.48,14.92 6.48,15.55 6.68,15.75 USB4.5 37.19,15.75 43.56,9.38 57.2,9.38 58.6,10.77 58.6,22.35 U12.70
STM_USB_DP: length 68.4
  Top Layer w0.203: USB4.8 8.1,14.25 8.25,14.41 8.25,15.1 8.1,15.25 ; 8.1,15.25 37.26,15.25 43.43,9.07 57.33,9.07 58.9,10.65 58.9,22.35 U12.71 ; 8.1,15.25 USB4.6
T_RST: length 10.2
  Top Layer w0.203: R70.1 41.52,45.73 U9.18
T_RXD: length 10.4
  Top Layer w0.203: U9.13 33.86,43.23 34.16,43.54 41.33,43.54 R68.1
T_SWCLK: length 30.8
  Top Layer w0.203: U9.26 29.74,53.67 29.97,53.9 34.8,53.9 38.61,50.09 38.61,48.7 39.24,48.06 v1(40.13,48.06) 41.73,48.06 R66.2 ; v1(40.13,44.76) 39.6,44.23 U9.15
  Bottom Layer w0.203: v1(40.13,44.76) v1(40.13,48.06)
T_SWDIO: length 18.2
  Top Layer w0.203: U9.27 29.24,52.61 R1.2 28.96,53.33 29.85,54.21 34.92,54.21 39.17,49.97 41.76,49.97 R67.2
T_SWDIO_IN: length 2.7
  Top Layer w0.203: U9.25 30.24,52.66 R1.1
T_TXD: length 12.7
  Top Layer w0.203: R69.1 38.83,42 37.59,43.24 34.29,43.24 32.79,41.73 U9.12
USB_DM: length 24.9
  Top Layer w0.203: R31.1 25.28,54.34 24.97,54.34 24.71,54.59 21.59,54.59 19.76,52.76 15.97,52.76 15.7,52.49 15.7,51.73 9.72,45.75 USB3.5 6.58,45.75 6.48,45.65 6.48,44.89 6.61,44.75 USB3.7
USB_DP: length 23.2
  Top Layer w0.203: 8.13,45.25 9.65,45.25 R33.1 16.85,52.46 19.88,52.46 21.71,54.28 24,54.28 24.36,53.93 R32.1 ; 8.13,45.25 USB3.6 ; 8.13,45.25 8.25,45.12 8.25,44.38 8.13,44.25 USB3.8
$1N668: length 5.3
  Top Layer w0.203: R6.1 R7.2 ; R6.1 18.29,23.02 18.29,24.08 18.58,24.38 ; R6.1 18.19,22.66 C4.1
$1N790: length 4.5
  Top Layer w0.203: U1.1 20.64,24.38 20.07,24.95 20.07,26.98 20.25,27.16 R8.1
$1N1377: length 9.1
  Top Layer w0.203: v1(30.35,4.63) 29.97,5.01 C12.2 29.16,3.39 R17.2
  Bottom Layer w0.203: v1(30.35,4.63) 33.66,4.63 34.04,5.01 v1(34.04,7.29)
$1N1393: length 6
  Top Layer w0.203: R18.2 R19.2 ; R18.2 26.03,4.89 26.03,6.15 26.53,6.65 U2.5 ; R18.2 27.62,4.87 C12.1
$1N1402: length 4.5
  Top Layer w0.203: U2.1 28.96,6.65 28.75,6.86 R11.1
$1N1798: length 5.3
  Top Layer w0.203: C18.1 84.45,48.28 R15.1 ; R15.1 R16.2 ; R15.1 82.84,48.44 U3.5
$1N1807: length 4.8
  Top Layer w0.203: R14.1 84.33,53.38 84.33,50.42 84.53,50.22 85.28,50.22 U3.1
$1N2536: length 1.6
  Top Layer w0.203: R18.1 26.03,3.38 R17.1
$1N2550: length 1.6
  Top Layer w0.203: R19.1 R20.1
$1N2789: length 1.6
  Top Layer w0.203: Q1.2 16.38,48.9 R33.2
$1N2864: length 5.2
  Top Layer w0.203: Q1.1 16.37,45.4 ; 16.37,45.4 R34.1 ; 16.37,45.4 16.32,45.45 14.34,45.45 ; R36.2 R35.1
$1N5010: length 8.4
  Top Layer w0.203: USB4.4 6.03,16.25 v1(5.97,16.19) ; R48.1 3.39,21.43 v1(3.75,21.07)
  Bottom Layer w0.203: v1(3.75,21.07) 5.08,19.74 5.08,17.07 v1(5.97,16.19)
$1N5011: length 12.4
  Top Layer w0.203: v1(5.97,13.64) 6.36,13.25 USB4.10 ; v1(2.41,20.76) 1.91,21.27 R49.1
  Bottom Layer w0.203: v1(2.41,20.76) 3.27,20.76 3.52,20.52 3.75,20.52 4.78,19.49 4.78,14.84 v1(5.97,13.64)
$2N1341: length 1.6
  Top Layer w0.203: LEDR.2 42.06,53.4 43.28,53.4 R2.2
$2N1351: length 2.8
  Top Layer w0.203: U9.44 21.09,45.23 R21.2
$2N1378: length 6.5
  Top Layer w0.203: C22.2 28.59,37.8 27.03,37.8 26.42,38.41 26.42,39.17 27.24,40 U9.6
$2N1379: length 8.3
  Top Layer w0.203: U9.5 26.74,40.01 25.91,39.17 25.91,37.12 X1.1 24.79,36.09 C21.2
$2N1471: length 5.8
  Top Layer w0.203: R25.1 20.87,40.31 25.02,40.31 25.24,40.54 U9.2
$2N1475: length 7
  Top Layer w0.203: R26.1 21.89,39.81 25.02,39.81 25.74,40.53 U9.3
$2N1617: length 2.4
  Top Layer w0.203: R27.1 34.13,46.73 U9.20
$2N1805: length 1.7
  Top Layer w0.203: R30.2 40.18,53.4 39.12,53.4 LEDG.1
$5N2075: length 4.6
  Top Layer w0.203: R45.1 65.42,32.05 65.42,33.46 64.96,33 U12.94
$5N5771: length 14.1
  Top Layer w0.203: U12.86 70.84,29 74.84,33 R56.1
$5N5804: length 13.4
  Top Layer w0.203: R57.1 72.45,28.5 U12.85
$5N5834: length 12.8
  Top Layer w0.203: R58.1 74.92,29 73.92,28 U12.84
$5N5864: length 12.6
  Top Layer w0.203: U12.83 74.45,27.5 R59.1
$5N11116: length 6
  Top Layer w0.203: U12.1 v1(61,39.3) ; v1(61.09,42.47) 61.09,43.37 R71.2
  Bottom Layer w0.203: v1(61.09,42.47) 61,42.47 v1(61,39.3)
$5N11170: length 1.7
  Top Layer w0.203: 62.67,43.45 62.73,43.51 LED3.2
$5N11241: length 1.8
  Top Layer w0.203: 74.8,12.46 72.95,12.46

## Copper pours and planes (outline as drawn; the poured copper is in the pictures)
+3.3V_ESP on Top Layer: 88.39,55.68 91.41,55.68 91.41,51.9 88.39,51.9
+3.3V_MCU on Top Layer: 24.38,29.73 29.14,29.73 29.14,25.96 24.38,25.96
+3.3V_MCU on Bottom Layer: 24.38,29.77 29.14,29.77 29.14,25.96 24.38,25.96
+5V on Top Layer: 7.92,17.7 4.97,17.7 4.32,17.05 4.32,13.11 5.11,12.31 7.95,12.31 7.95,13.03 5.8,13.03 5.33,13.49 5.33,16.54 5.72,16.92 7.92,16.92
+5V on Top Layer: 6.83,13.09 10.37,13.09 10.37,12.27 6.83,12.27
+5V on Top Layer: 6.86,47.91 10.22,47.91 10.22,47.17 6.86,47.17
+5V on Top Layer: 6.83,17.92 10.37,17.92 10.37,17.1 6.83,17.1
+5V on Top Layer: 6.83,42.84 10.18,42.84 10.18,42.1 6.83,42.1
+5V on Top Layer: 4.32,46.92 5.33,46.92 5.33,16.57 4.32,16.57
+5V on Top Layer: 7.92,47.7 4.97,47.7 4.32,47.05 4.32,43.11 5.11,42.31 7.95,42.31 7.95,43.03 5.8,43.03 5.33,43.49 5.33,46.54 5.72,46.92 7.92,46.92
GND on Top Layer: 0,60 100,60 100,0 0,0
GND on Bottom Layer: 0,60 100,60 100,0 0,0
$1N409 on Top Layer: 20.57,26.6 23.5,26.6 23.5,25.96 20.57,25.96
$1N1374 on Top Layer: 29.29,8.82 31.5,8.82 31.5,8.27 29.29,8.27
$1N1377 on Top Layer: 32.77,11.99 35.53,11.99 35.53,6.84 32.77,6.84
$1N1779 on Top Layer: 84.96,52.38 87.38,52.38 87.38,51.75 84.96,51.75
